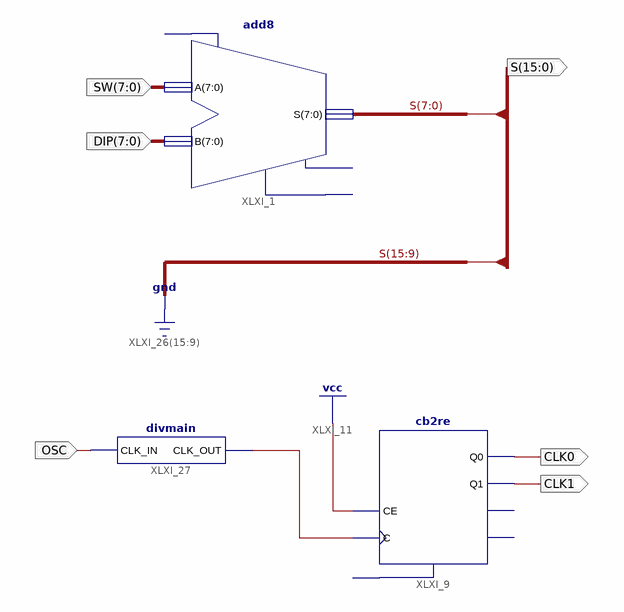
[diagram p0: schematic sheet 1]
// Xilinx ISE schematic adder8bit.sch (spartan6) as structural Verilog: 3 symbols, 6 ports
module adder8bit (
  input  [7:0] SW,
  input  [7:0] DIP,
  input  OSC,
  output [15:0] S,
  output CLK0,
  output CLK1
);

  wire XLXN_7;

  add8 XLXI_1 (.A(SW), .B(DIP), .S(S[7:0]));  // open: CI, CO, OFL
  cb2re XLXI_9 (.C(XLXN_7), .CE(1'b1), .Q0(CLK0), .Q1(CLK1));  // open: R, CEO, TC
  divmain XLXI_27 (.CLK_IN(OSC), .CLK_OUT(XLXN_7));

  assign S[15:9] = {7{1'b0}};
endmodule
